# Altium schematic sheet IN_Connectors.SchDoc
size A4; SheetNumber: 14; SheetTotal: 15
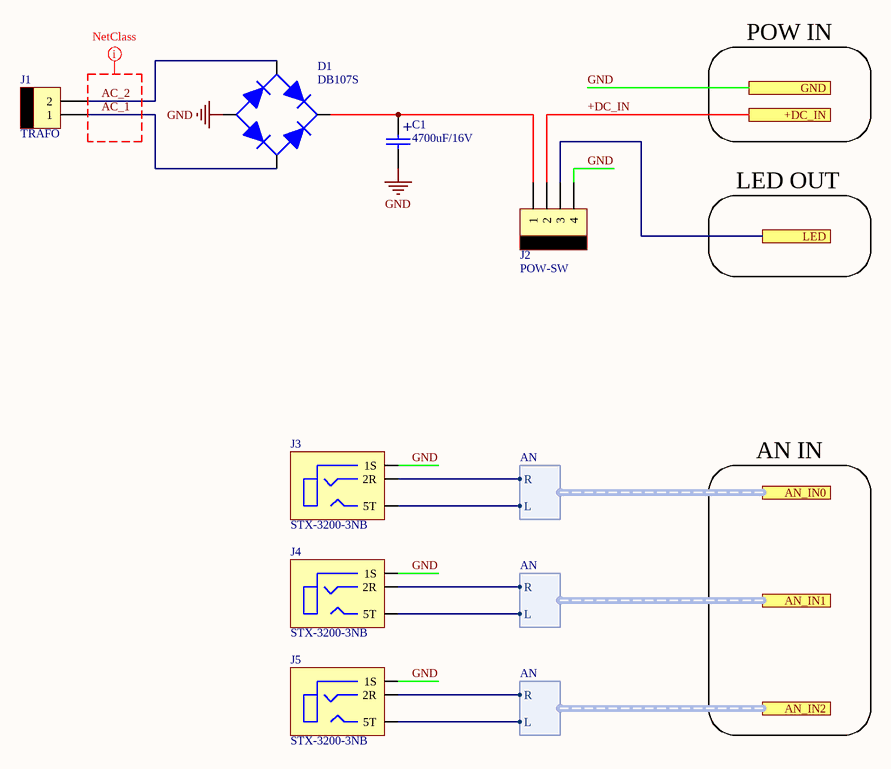
[diagram p0: IN_Connectors.SchDoc]

## Parts
C1  4700uF/16V  [CAP200RP]
D1  DB107S  [DBS]
J1  TRAFO  [MOLEX-2]
J2  POW-SW  [MOLEX-4]
J3  STX-3200-3NB  [JACK-3.5-3POS]
J4  STX-3200-3NB  [JACK-3.5-3POS]
J5  STX-3200-3NB  [JACK-3.5-3POS]

## Ports
+DC_IN, AN_IN0 (harness AN), AN_IN1 (harness AN), AN_IN2 (harness AN), GND, LED

## Harnesses
AN: L, R

## Nets
GND: C1.2 D1.4(-) J2.4 J3.1S J4.1S J5.1S ; port GND
+DC_IN: J2.2 ; port +DC_IN
AC_1: D1.3(AC-) J1.1
AC_2: D1.1(AC+) J1.2
LED: J2.3 ; port LED
NetC1_1: C1.1 D1.2(+) J2.1
NetJ3_2R: J3.2R ; port AN_IN0.R
NetJ3_5T: J3.5T ; port AN_IN0.L
NetJ4_2R: J4.2R ; port AN_IN1.R
NetJ4_5T: J4.5T ; port AN_IN1.L
NetJ5_2R: J5.2R ; port AN_IN2.R
NetJ5_5T: J5.5T ; port AN_IN2.L

## Layout directives
net class AC_IN: AC_1, AC_2

## Notes on the sheet
- POW IN
- LED OUT
- AN IN
- (in symbol CAPPOL-THT) +

## Library data of the parts
C1 = CAPPOL-THT
D1 = DB107S: Bridge Rectifier Single Phase Standard 1000 V Surface Mount 4-MiniDIP; JLCPart: C5377
J1 = MOLEX-2
J2 = MOLEX-4